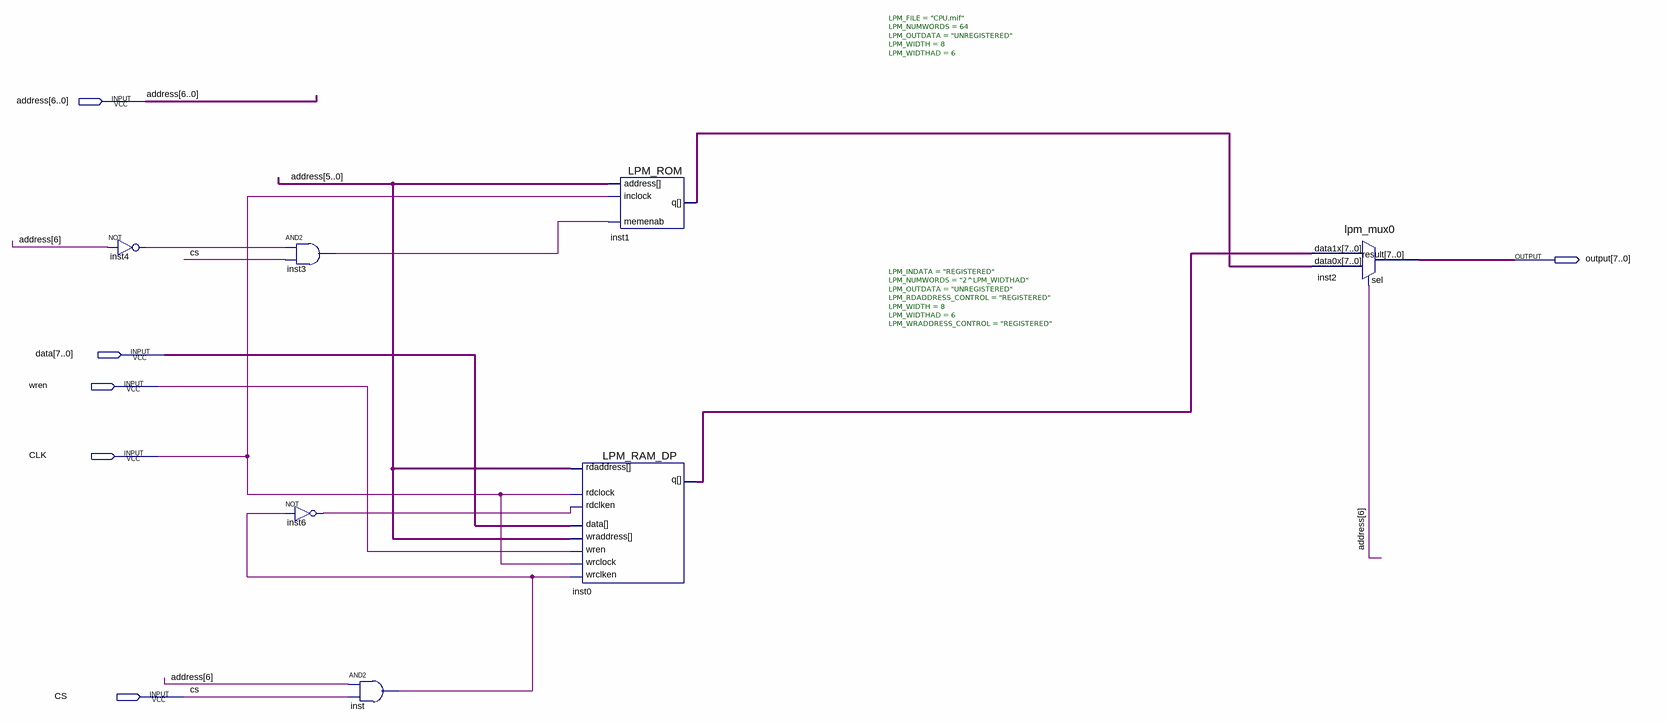
[diagram p0: schematic sheet]
// Quartus schematic Block2.bdf as structural Verilog: 7 symbols, 6 pins
module Block2 (
  input  [6:0] address,
  input  [7:0] data,
  input  wren,
  input  CLK,
  input  CS,
  output [7:0] \output 
);

  wire inst3_out, inst4_out, inst6_out, inst_out;
  wire [7:0] inst0_q, inst1_q;

  not inst4 (inst4_out, address[6]);
  and inst3 (inst3_out, inst4_out, CS);
  not inst6 (inst6_out, inst_out);
  and inst (inst_out, address[6], CS);
  LPM_RAM_DP #(.LPM_INDATA("REGISTERED"), .LPM_NUMWORDS("2^LPM_WIDTHAD"), .LPM_OUTDATA("UNREGISTERED"), .LPM_RDADDRESS_CONTROL("REGISTERED"), .LPM_WIDTH(8), .LPM_WIDTHAD(6), .LPM_WRADDRESS_CONTROL("REGISTERED")) inst0 (
    .data(data), .rdaddress(address[5:0]), .rdclken(inst6_out), .rdclock(CLK), .wraddress(address[5:0]),
    .wrclken(inst_out), .wrclock(CLK), .wren(wren), .q(inst0_q));
  LPM_ROM #(.LPM_FILE("CPU.mif"), .LPM_NUMWORDS(64), .LPM_OUTDATA("UNREGISTERED"), .LPM_WIDTH(8), .LPM_WIDTHAD(6)) inst1 (
    .address(address[5:0]), .inclock(CLK), .memenab(inst3_out), .q(inst1_q));
  lpm_mux0 inst2 (.data1x(inst0_q), .data0x(inst1_q), .sel(address[6]), .result(\output ));
endmodule
